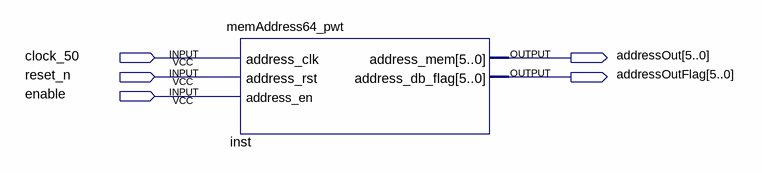
[diagram p0: schematic sheet]
// Quartus schematic address64Test.bdf as structural Verilog: 1 symbols, 5 pins
module address64Test (
  input  clock_50,
  input  reset_n,
  input  enable,
  output [5:0] addressOut,
  output [5:0] addressOutFlag
);

  memAddress64_pwt inst (
    .address_clk(clock_50), .address_rst(reset_n), .address_en(enable), .address_mem(addressOut),
    .address_db_flag(addressOutFlag));
endmodule
